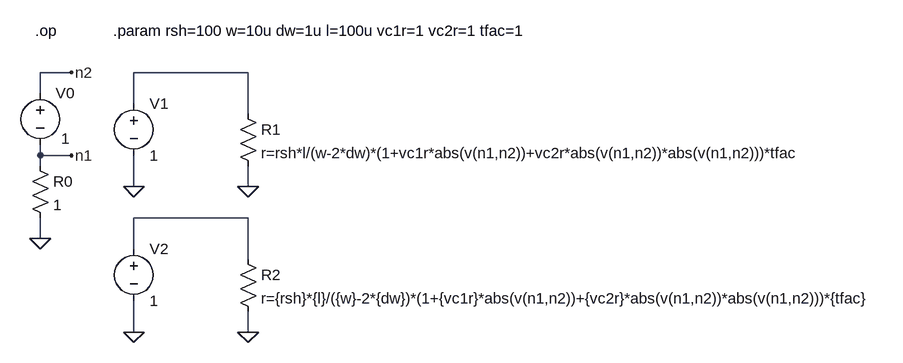
[diagram p0: schematic resistor_equation1.asc]
resistor_equation1.asc, the LTspice schematic file:
Version 4
SHEET 1 2052 680
WIRE 0 32 -48 32
WIRE 272 32 96 32
WIRE -48 64 -48 32
WIRE 96 80 96 32
WIRE 272 96 272 32
WIRE -48 160 -48 144
WIRE 0 160 -48 160
WIRE -48 176 -48 160
WIRE 96 208 96 160
WIRE 272 208 272 176
WIRE 272 256 96 256
WIRE -48 288 -48 256
WIRE 96 304 96 256
WIRE 272 320 272 256
WIRE 96 432 96 384
WIRE 272 432 272 400
FLAG 272 208 0
FLAG 96 208 0
FLAG -48 288 0
FLAG 0 32 n2
FLAG 0 160 n1
FLAG 272 432 0
FLAG 96 432 0
SYMBOL res 256 80 R0
SYMATTR InstName R1
SYMATTR Value r=rsh*l/(w-2*dw)*(1+vc1r*abs(v(n1,n2))+vc2r*abs(v(n1,n2))*abs(v(n1,n2)))*tfac
SYMBOL voltage 96 64 R0
SYMATTR InstName V1
SYMATTR Value 1
SYMBOL voltage -48 48 R0
WINDOW 3 32 86 Left 0
SYMATTR InstName V0
SYMATTR Value 1
SYMBOL res -64 160 R0
SYMATTR InstName R0
SYMATTR Value 1
SYMBOL res 256 304 R0
SYMATTR InstName R2
SYMATTR Value r={rsh}*{l}/({w}-2*{dw})*(1+{vc1r}*abs(v(n1,n2))+{vc2r}*abs(v(n1,n2))*abs(v(n1,n2)))*{tfac}
SYMBOL voltage 96 288 R0
SYMATTR InstName V2
SYMATTR Value 1
TEXT -56 -32 Left 0 !.op
TEXT 64 -32 Left 0 !.param rsh=100 w=10u dw=1u l=100u vc1r=1 vc2r=1 tfac=1

The netlist it stands for:
* resistor_equation1.asc
R1 N001 0 r=rsh*l/(w-2*dw)*(1+vc1r*abs(v(n1,n2))+vc2r*abs(v(n1,n2))*abs(v(n1,n2)))*tfac
V1 N001 0 1
V0 n2 n1 1
R0 n1 0 1
R2 N002 0 r={rsh}*{l}/({w}-2*{dw})*(1+{vc1r}*abs(v(n1,n2))+{vc2r}*abs(v(n1,n2))*abs(v(n1,n2)))*{tfac}
V2 N002 0 1
.op
.param rsh=100 w=10u dw=1u l=100u vc1r=1 vc2r=1 tfac=1
.backanno
.end